# Altium schematic sheet 04 PCIe.SchDoc
size A3
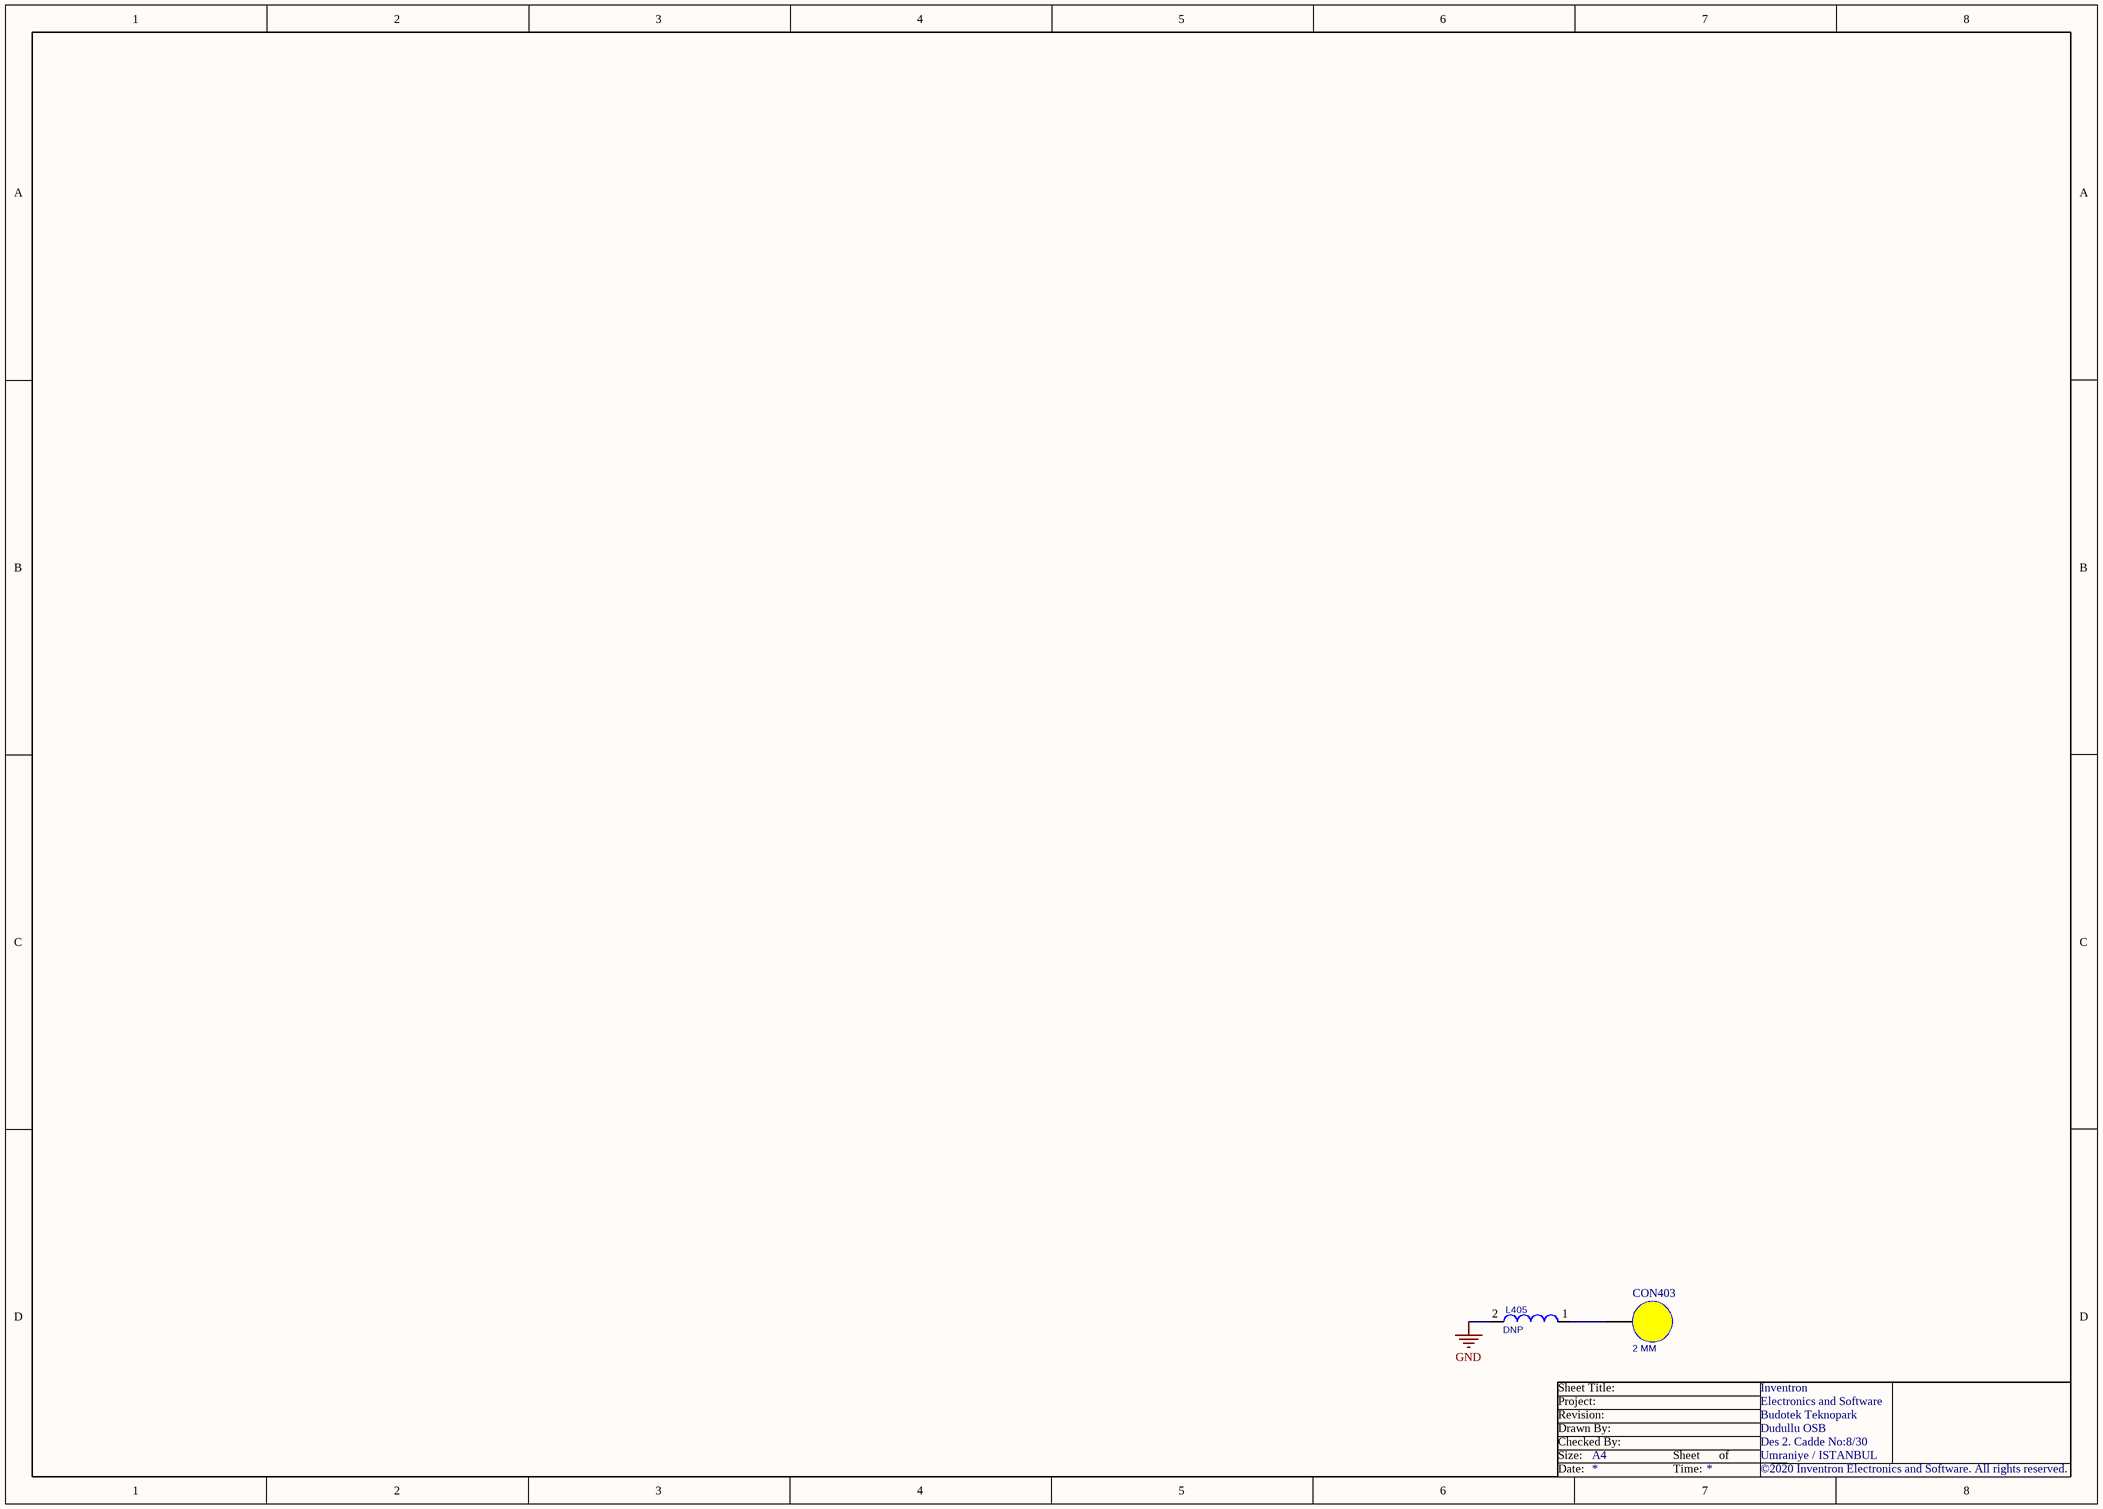
[diagram p0: 04 PCIe.SchDoc]

## Parts
CON403  2 MM  [9774045243R]
L405  ASSY_OPT: DNP  [0603_RES]  (hidden comment: FERRITE 0603)

## Nets
GND: L405.2
NetCON403_1: CON403.1 L405.1

## Notes on the sheet
- Sheet Title:
- Inventron
- Size:
- Drawn By:
- Revision:
- Project:
- Checked By:
- A4
- Sheet
- of
- Budotek Teknopark
- Dudullu OSB
- Des 2. Cadde No:8/30
- Umraniye / ISTANBUL
- Electronics and Software
- Date:
- Time:
- ©2020 Inventron Electronics and Software. All rights reserved.

## Library data of the parts
CON403 = CON-9774045243R: Round Standoff Threaded M2x0.4 Steel 0.177" (4.50mm); Manufacturer-1: Würth Elektronik; Class: Connector; Manufacturer Part Number-1: 9774045243R; Footprint: *; Manufacturer-2: *; Manufacturer Part Number-2: *; Inventron Stock No: *; Created By: EE; Created Date: *; Checked By: *; ASSY_OPT: *; Dimensions: *; Unit Price: 0.739; Revision Date/Note: *; Price Break: 100; Opt. Temp.: *; Features: *
L405 = IND-FERRITE 0603: FERRITE BEAD 0603; Manufacturer Part Number-1: MPZ1608S260ATAH0; Manufacturer-1: TDK; Class: Inductor; Manufacturer-2: *; Inventron Stock No: *; Checked By: *; Dimensions: *; Revision Date/Note: *